# Altium schematic sheet AD.SchDoc
size A2
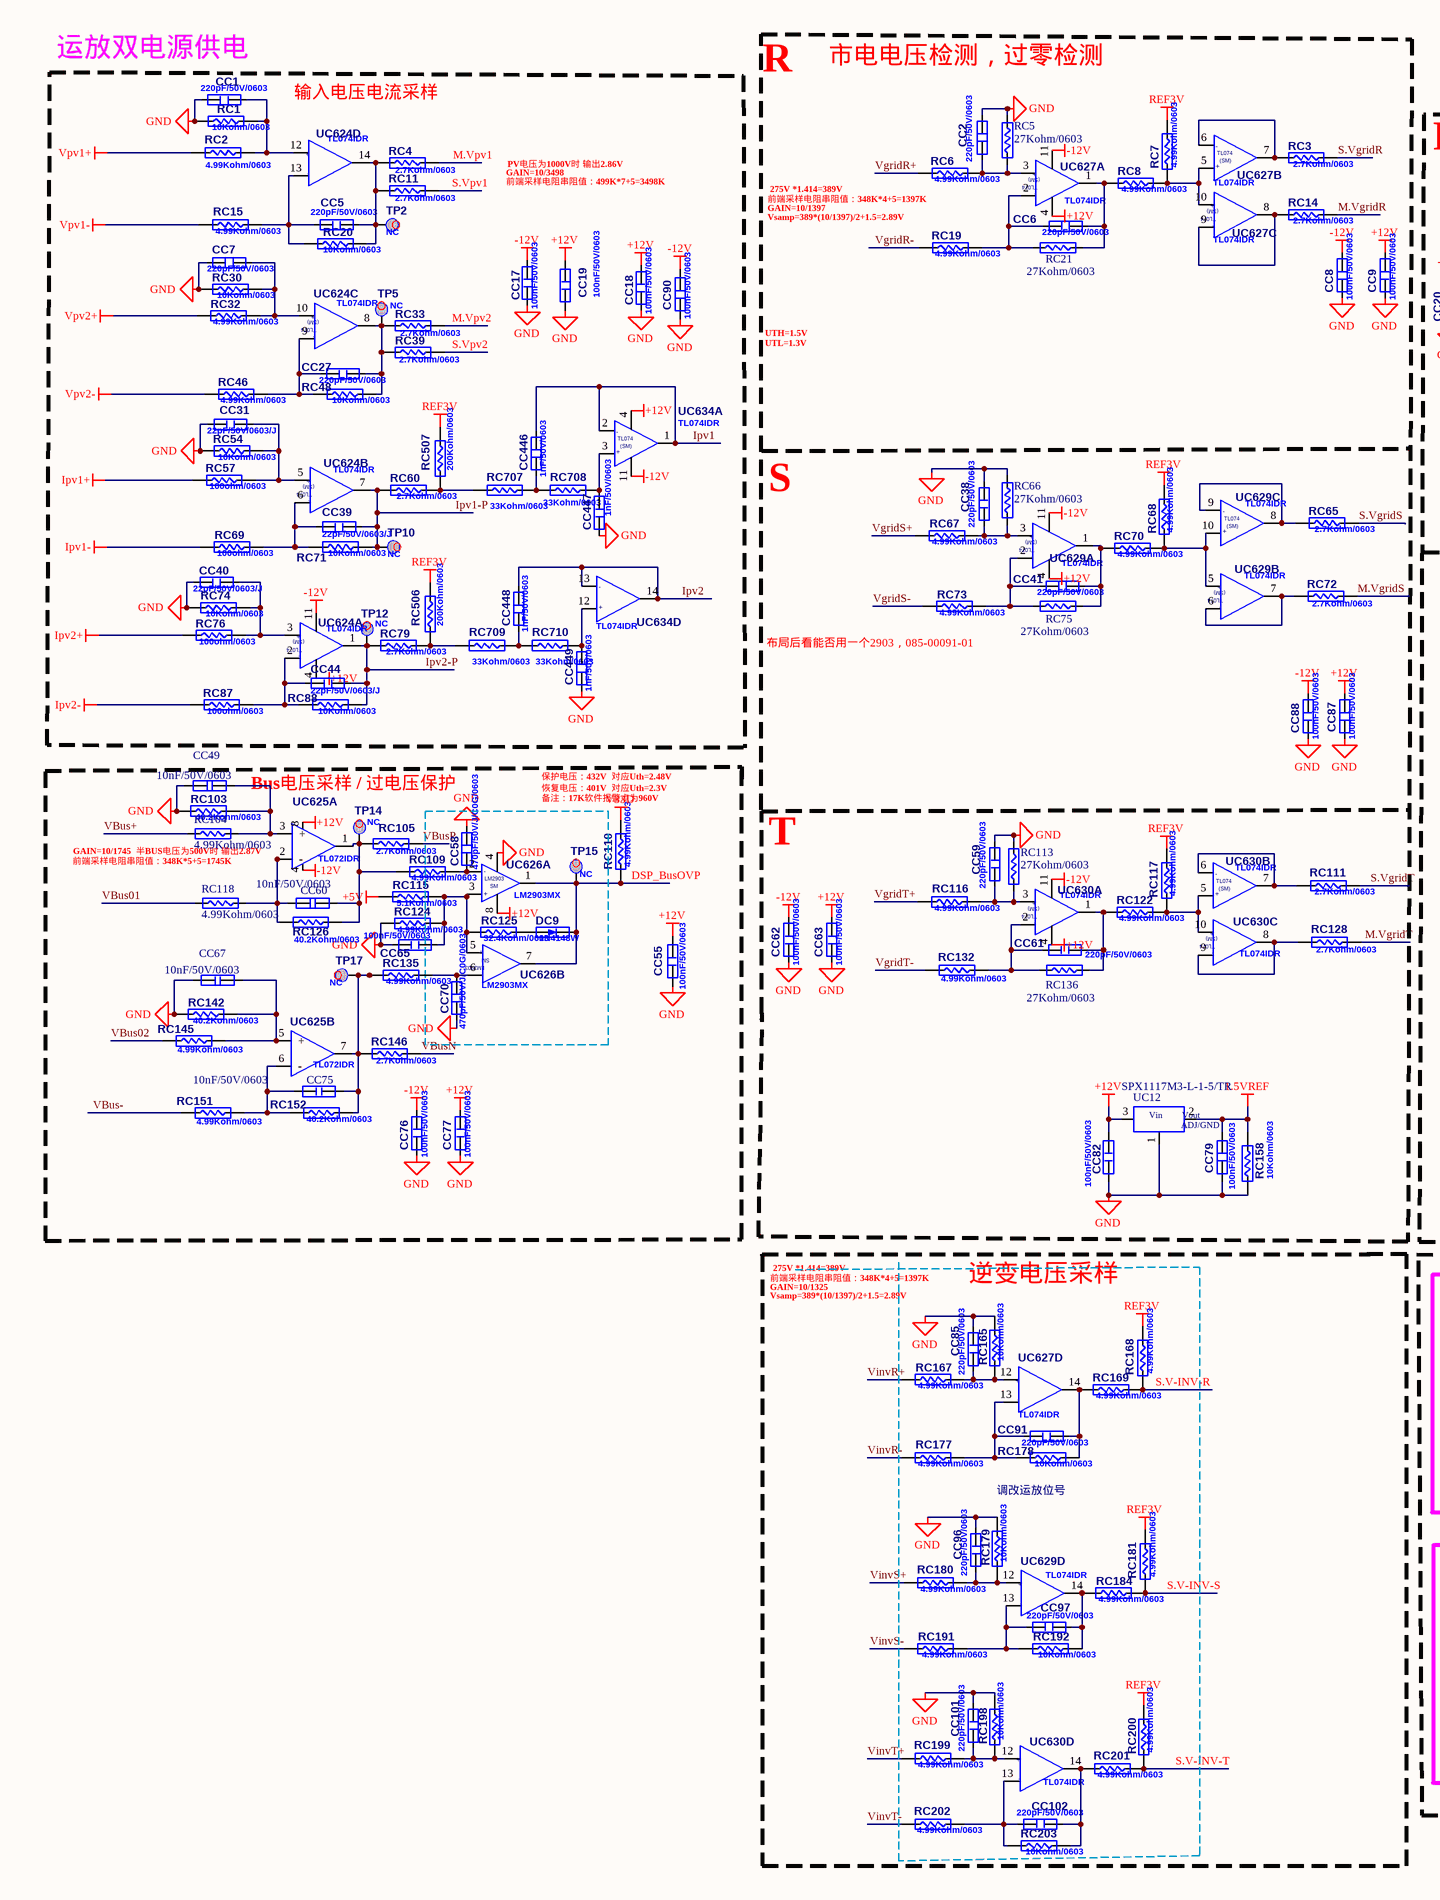
[diagram p0: AD.SchDoc, left]
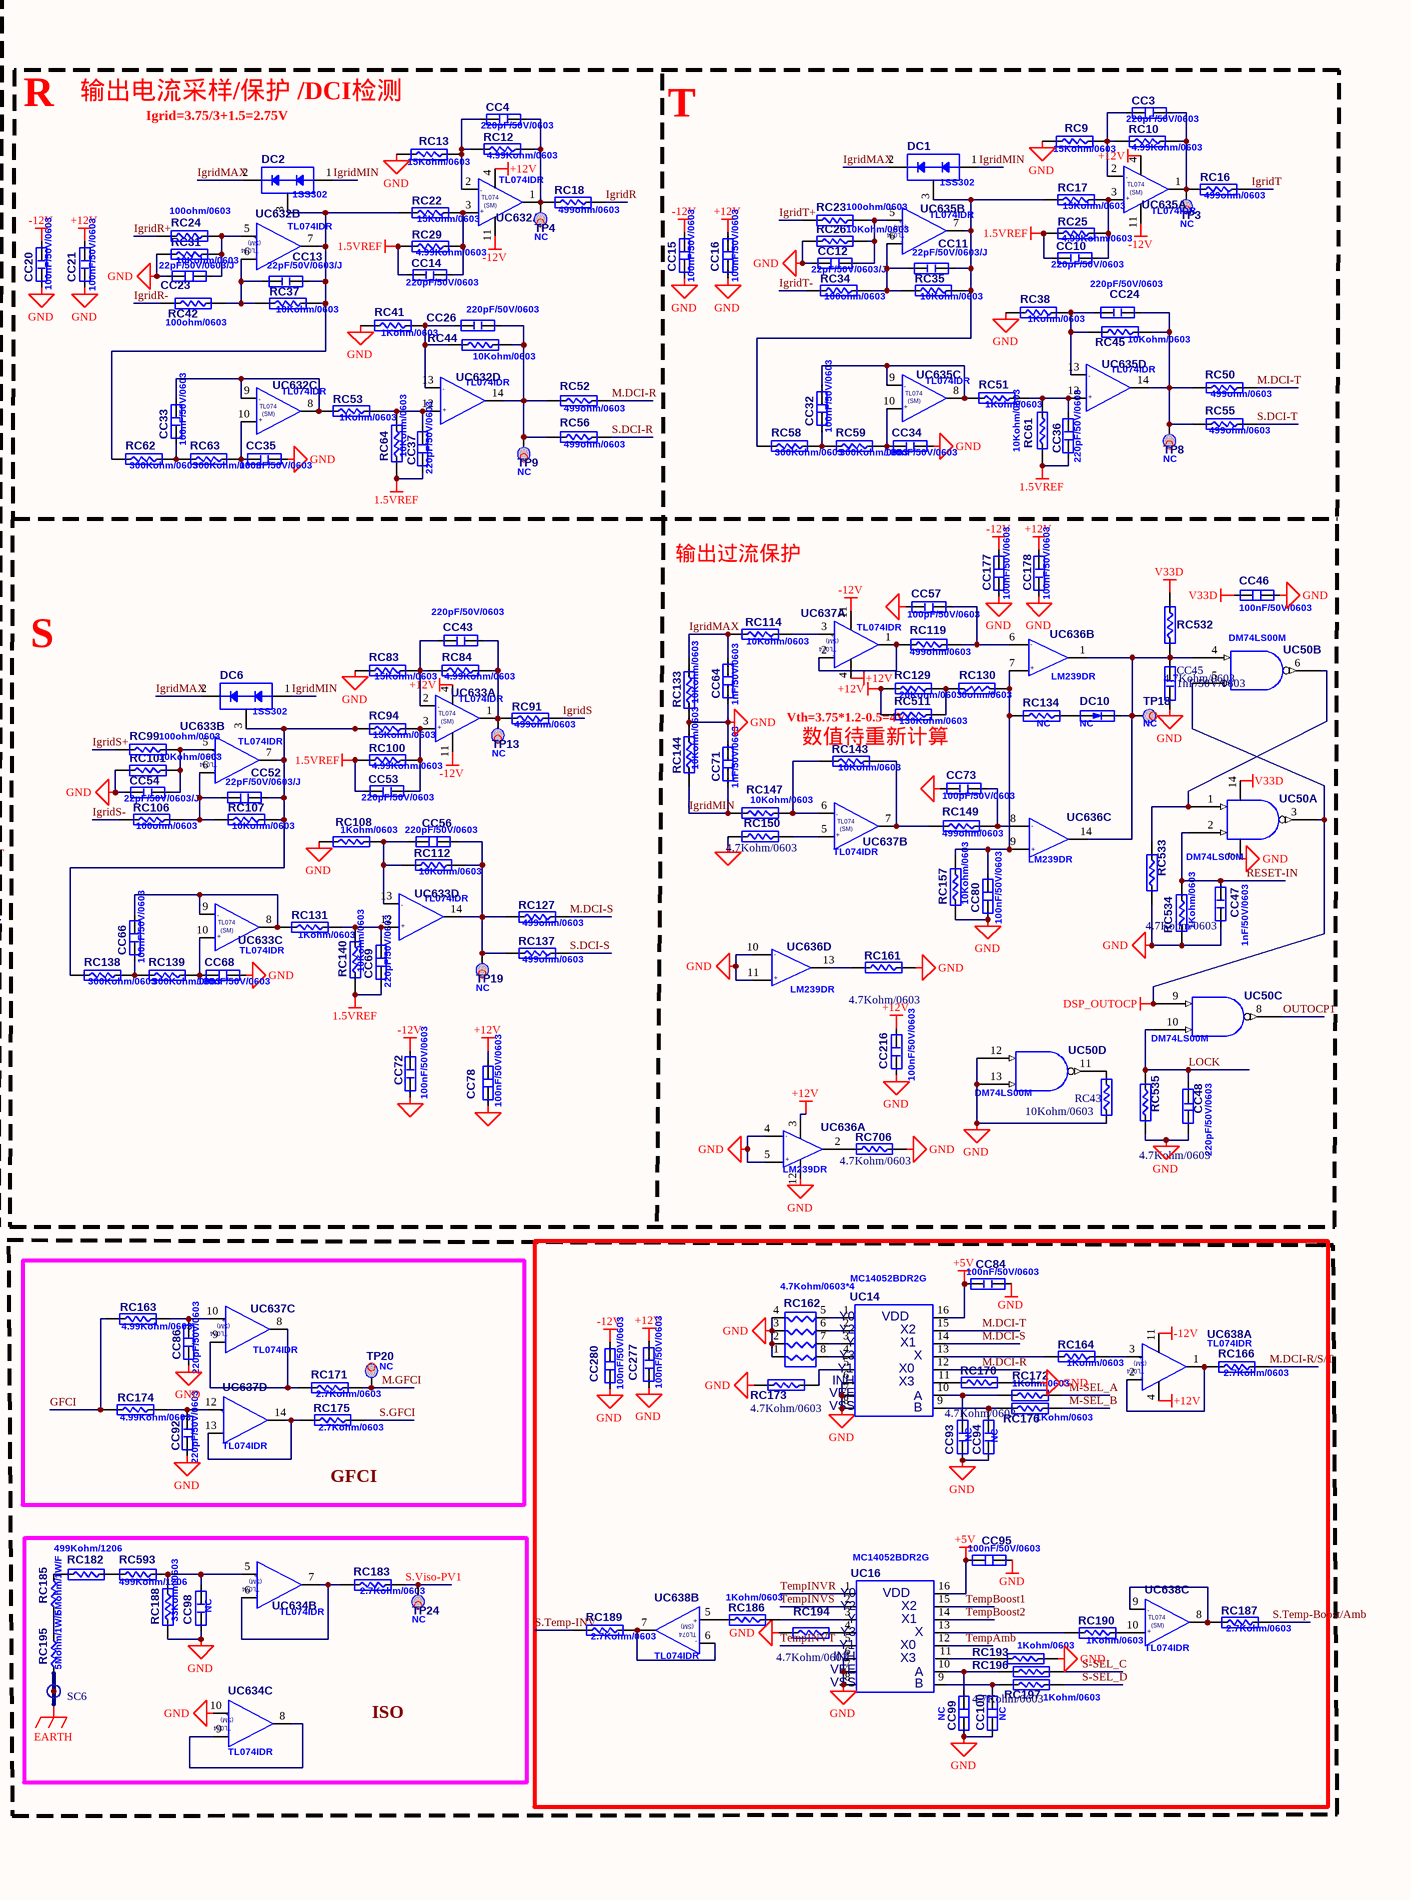
[diagram p1: AD.SchDoc, right]

## Parts
CC1  value 220pF/50V/0603  [CC1608-0603]  (hidden comment: 023-221220-0)
CC2  value 220pF/50V/0603  [CC1608-0603]  (hidden comment: 023-221220-0)
CC3  value 220pF/50V/0603  [CC1608-0603]  (hidden comment: 023-221220-0)
CC4  value 220pF/50V/0603  [CC1608-0603]  (hidden comment: 023-221220-0)
CC5  value 220pF/50V/0603  [CC1608-0603]  (hidden comment: 023-221220-0)
CC6  value 220pF/50V/0603  [CC1608-0603]  (hidden comment: 023-221220-0)
CC7  value 220pF/50V/0603  [CC1608-0603]  (hidden comment: 023-221220-0)
CC8  value 100nF/50V/0603  [CC1608-0603]  (hidden comment: 023-105220-0)
CC9  value 100nF/50V/0603  [CC1608-0603]  (hidden comment: 023-105220-0)
CC10  value 220pF/50V/0603  [CC1608-0603]  (hidden comment: 023-221220-0)
CC11  value 22pF/50V/0603/J  [CC1608-0603]  (hidden comment: 023-220220-0)
CC12  value 22pF/50V/0603/J  [CC1608-0603]  (hidden comment: 023-220220-0)
CC13  value 22pF/50V/0603/J  [CC1608-0603]  (hidden comment: 023-220220-0)
CC14  value 220pF/50V/0603  [CC1608-0603]  (hidden comment: 023-221220-0)
CC15  value 100nF/50V/0603  [CC1608-0603]  (hidden comment: 023-105220-0)
CC16  value 100nF/50V/0603  [CC1608-0603]  (hidden comment: 023-105220-0)
CC17  value 100nF/50V/0603  [CC1608-0603]  (hidden comment: 023-105220-0)
CC18  value 100nF/50V/0603  [CC1608-0603]  (hidden comment: 023-105220-0)
CC19  value 100nF/50V/0603  [CC1608-0603]  (hidden comment: 023-105220-0)
CC20  value 100nF/50V/0603  [CC1608-0603]  (hidden comment: 023-105220-0)
CC21  value 100nF/50V/0603  [CC1608-0603]  (hidden comment: 023-105220-0)
CC23  value 22pF/50V/0603/J  [CC1608-0603]  (hidden comment: 023-220220-0)
CC24  value 220pF/50V/0603  [CC1608-0603]  (hidden comment: 023-221220-0)
CC26  value 220pF/50V/0603  [CC1608-0603]  (hidden comment: 023-221220-0)
CC27  value 220pF/50V/0603  [CC1608-0603]  (hidden comment: 023-221220-0)
CC31  value 22pF/50V/0603/J  [CC1608-0603]  (hidden comment: 023-220220-0)
CC32  value 100nF/50V/0603  [CC1608-0603]  (hidden comment: 023-105220-0)
CC33  value 100nF/50V/0603  [CC1608-0603]  (hidden comment: 023-105220-0)
CC34  value 100nF/50V/0603  [CC1608-0603]  (hidden comment: 023-105220-0)
CC35  value 100nF/50V/0603  [CC1608-0603]  (hidden comment: 023-105220-0)
CC36  value 220pF/50V/0603  [CC1608-0603]  (hidden comment: 023-221220-0)
CC37  value 220pF/50V/0603  [CC1608-0603]  (hidden comment: 023-221220-0)
CC38  value 220pF/50V/0603  [CC1608-0603]  (hidden comment: 023-221220-0)
CC39  value 22pF/50V/0603/J  [CC1608-0603]  (hidden comment: 023-220220-0)
CC40  value 22pF/50V/0603/J  [CC1608-0603]  (hidden comment: 023-220220-0)
CC41  value 220pF/50V/0603  [CC1608-0603]  (hidden comment: 023-221220-0)
CC43  value 220pF/50V/0603  [CC1608-0603]  (hidden comment: 023-221220-0)
CC44  value 22pF/50V/0603/J  [CC1608-0603]  (hidden comment: 023-220220-0)
CC45  value 1nF/50V/0603  [C0603SM]  (hidden comment: 023-102220-0)
CC46  value 100nF/50V/0603  [CC1608-0603]  (hidden comment: 023-105220-0)
CC47  value 1nF/50V/0603  [CC1608-0603]  (hidden comment: 023-102220-0)
CC48  value 220pF/50V/0603  [CC1608-0603]  (hidden comment: 023-221220-0)
CC49  value 10nF/50V/0603  [C0603SM]  (hidden comment: 023-103220-0)
CC52  value 22pF/50V/0603/J  [CC1608-0603]  (hidden comment: 023-220220-0)
CC53  value 220pF/50V/0603  [CC1608-0603]  (hidden comment: 023-221220-0)
CC54  value 22pF/50V/0603/J  [CC1608-0603]  (hidden comment: 023-220220-0)
CC55  value 100nF/50V/0603  [CC1608-0603]  (hidden comment: 023-105220-0)
CC56  value 220pF/50V/0603  [CC1608-0603]  (hidden comment: 023-221220-0)
CC57  value 100pF/50V/0603  [CC1608-0603]  (hidden comment: 023-101220-0)
CC58  value 470pF/50V/J/C0G/0603  [CC1608-0603]  (hidden comment: 023-471220-0)
CC59  value 220pF/50V/0603  [CC1608-0603]  (hidden comment: 023-221220-0)
CC60  value 10nF/50V/0603  [C0603SM]  (hidden comment: 023-103220-0)
CC61  value 220pF/50V/0603  [CC1608-0603]  (hidden comment: 023-221220-0)
CC62  value 100nF/50V/0603  [CC1608-0603]  (hidden comment: 023-105220-0)
CC63  value 100nF/50V/0603  [CC1608-0603]  (hidden comment: 023-105220-0)
CC64  value 1nF/50V/0603  [CC1608-0603]  (hidden comment: 023-102220-0)
CC65  value 100nF/50V/0603  [CC1608-0603]  (hidden comment: 023-105220-0)
CC66  value 100nF/50V/0603  [CC1608-0603]  (hidden comment: 023-105220-0)
CC67  value 10nF/50V/0603  [C0603SM]  (hidden comment: 023-103220-0)
CC68  value 100nF/50V/0603  [CC1608-0603]  (hidden comment: 023-105220-0)
CC69  value 220pF/50V/0603  [CC1608-0603]  (hidden comment: 023-221220-0)
CC70  value 470pF/50V/J/C0G/0603  [CC1608-0603]  (hidden comment: 023-471220-0)
CC71  value 1nF/50V/0603  [CC1608-0603]  (hidden comment: 023-102220-0)
CC72  value 100nF/50V/0603  [CC1608-0603]  (hidden comment: 023-105220-0)
CC73  value 100pF/50V/0603  [CC1608-0603]  (hidden comment: 023-101220-0)
CC75  value 10nF/50V/0603  [C0603SM]  (hidden comment: 023-103220-0)
CC76  value 100nF/50V/0603  [CC1608-0603]  (hidden comment: 023-105220-0)
CC77  value 100nF/50V/0603  [CC1608-0603]  (hidden comment: 023-105220-0)
CC78  value 100nF/50V/0603  [CC1608-0603]  (hidden comment: 023-105220-0)
CC79  value 100nF/50V/0603  [CC1608-0603]  (hidden comment: 023-105220-0)
CC80  value 100nF/50V/0603  [CC1608-0603]  (hidden comment: 023-105220-0)
CC82  value 100nF/50V/0603  [CC1608-0603]  (hidden comment: 023-105220-0)
CC84  value 100nF/50V/0603  [CC1608-0603]  (hidden comment: 023-105220-0)
CC85  value 220pF/50V/0603  [CC1608-0603]  (hidden comment: 023-221220-0)
CC86  value 220pF/50V/0603  [CC1608-0603]  (hidden comment: 023-221220-0)
CC87  value 100nF/50V/0603  [CC1608-0603]  (hidden comment: 023-105220-0)
CC88  value 100nF/50V/0603  [CC1608-0603]  (hidden comment: 023-105220-0)
CC90  value 100nF/50V/0603  [CC1608-0603]  (hidden comment: 023-105220-0)
CC91  value 220pF/50V/0603  [CC1608-0603]  (hidden comment: 023-221220-0)
CC92  value 220pF/50V/0603  [CC1608-0603]  (hidden comment: 023-221220-0)
CC93  NC  [CC1608-0603]
CC94  NC  [CC1608-0603]
CC95  value 100nF/50V/0603  [CC1608-0603]  (hidden comment: 023-105220-0)
CC96  value 220pF/50V/0603  [CC1608-0603]  (hidden comment: 023-221220-0)
CC97  value 220pF/50V/0603  [CC1608-0603]  (hidden comment: 023-221220-0)
CC98  NC  [CC1608-0603]
CC99  NC  [CC1608-0603]
CC100  NC  [CC1608-0603]
CC101  value 220pF/50V/0603  [CC1608-0603]  (hidden comment: 023-221220-0)
CC102  value 220pF/50V/0603  [CC1608-0603]  (hidden comment: 023-221220-0)
CC177  value 100nF/50V/0603  [CC1608-0603]  (hidden comment: 023-105220-0)
CC178  value 100nF/50V/0603  [CC1608-0603]  (hidden comment: 023-105220-0)
CC216  value 100nF/50V/0603  [CC1608-0603]  (hidden comment: 023-105220-0)
CC277  value 100nF/50V/0603  [CC1608-0603]  (hidden comment: 023-105220-0)
CC280  value 100nF/50V/0603  [CC1608-0603]  (hidden comment: 023-105220-0)
CC446  value 1nF/50V/0603  [CC1608-0603]  (hidden comment: 023-102220-0)
CC447  value 1nF/50V/0603  [CC1608-0603]  (hidden comment: 023-102220-0)
CC448  value 1nF/50V/0603  [CC1608-0603]  (hidden comment: 023-102220-0)
CC449  value 1nF/50V/0603  [CC1608-0603]  (hidden comment: 023-102220-0)
DC1  value 1SS302  [SC-70]  (hidden comment: 060-610010-0)
DC2  value 1SS302  [SC-70]  (hidden comment: 060-610010-0)
DC6  value 1SS302  [SC-70]  (hidden comment: 060-610010-0)
DC9  value 1N4148W  [SOD-123]  (hidden comment: 060-500010-0)
DC10  NC  [SOD-123]
RC1  value 10Kohm/0603  [R1608-0603]  (hidden comment: 011-103020-0)
RC2  value 4.99Kohm/0603  [R1608-0603]  (hidden comment: 011-492020-0)
RC3  value 2.7Kohm/0603  [R1608-0603]  (hidden comment: 011-272020-0)
RC4  value 2.7Kohm/0603  [R1608-0603]  (hidden comment: 011-272020-0)
RC5  value 27Kohm/0603  [R0603SM]  (hidden comment: 011-273020-0)
RC6  value 4.99Kohm/0603  [R1608-0603]  (hidden comment: 011-492020-0)
RC7  value 4.99Kohm/0603  [R1608-0603]  (hidden comment: 011-492020-0)
RC8  value 4.99Kohm/0603  [R1608-0603]  (hidden comment: 011-492020-0)
RC9  value 15Kohm/0603  [R1608-0603]  (hidden comment: 011-153020-0)
RC10  value 4.99Kohm/0603  [R1608-0603]  (hidden comment: 011-492020-0)
RC11  value 2.7Kohm/0603  [R1608-0603]  (hidden comment: 011-272020-0)
RC12  value 4.99Kohm/0603  [R1608-0603]  (hidden comment: 011-492020-0)
RC13  value 15Kohm/0603  [R1608-0603]  (hidden comment: 011-153020-0)
RC14  value 2.7Kohm/0603  [R1608-0603]  (hidden comment: 011-272020-0)
RC15  value 4.99Kohm/0603  [R1608-0603]  (hidden comment: 011-492020-0)
RC16  value 499ohm/0603  [R1608-0603]  (hidden comment: 011-491020-0)
RC17  value 15Kohm/0603  [R1608-0603]  (hidden comment: 011-153020-0)
RC18  value 499ohm/0603  [R1608-0603]  (hidden comment: 011-491020-0)
RC19  value 4.99Kohm/0603  [R1608-0603]  (hidden comment: 011-492020-0)
RC20  value 10Kohm/0603  [R1608-0603]  (hidden comment: 011-103020-0)
RC21  value 27Kohm/0603  [R0603SM]  (hidden comment: 011-273020-0)
RC22  value 15Kohm/0603  [R1608-0603]  (hidden comment: 011-153020-0)
RC23  value 100ohm/0603  [R1608-0603]  (hidden comment: 011-101020-0)
RC24  value 100ohm/0603  [R1608-0603]  (hidden comment: 011-101020-0)
RC25  value 4.99Kohm/0603  [R1608-0603]  (hidden comment: 011-492020-0)
RC26  value 10Kohm/0603  [R1608-0603]  (hidden comment: 011-103020-0)
RC29  value 4.99Kohm/0603  [R1608-0603]  (hidden comment: 011-492020-0)
RC30  value 10Kohm/0603  [R1608-0603]  (hidden comment: 011-103020-0)
RC31  value 10Kohm/0603  [R1608-0603]  (hidden comment: 011-103020-0)
RC32  value 4.99Kohm/0603  [R1608-0603]  (hidden comment: 011-492020-0)
RC33  value 2.7Kohm/0603  [R1608-0603]  (hidden comment: 011-272020-0)
RC34  value 100ohm/0603  [R1608-0603]  (hidden comment: 011-101020-0)
RC35  value 10Kohm/0603  [R1608-0603]  (hidden comment: 011-103020-0)
RC37  value 10Kohm/0603  [R1608-0603]  (hidden comment: 011-103020-0)
RC38  value 1Kohm/0603  [R1608-0603]  (hidden comment: 011-102020-0)
RC39  value 2.7Kohm/0603  [R1608-0603]  (hidden comment: 011-272020-0)
RC41  value 1Kohm/0603  [R1608-0603]  (hidden comment: 011-102020-0)
RC42  value 100ohm/0603  [R1608-0603]  (hidden comment: 011-101020-0)
RC43  value 10Kohm/0603  [R0603SM]  (hidden comment: 011-103020-0)
RC44  value 10Kohm/0603  [R1608-0603]  (hidden comment: 011-103020-0)
RC45  value 10Kohm/0603  [R1608-0603]  (hidden comment: 011-103020-0)
RC46  value 4.99Kohm/0603  [R1608-0603]  (hidden comment: 011-492020-0)
RC48  value 10Kohm/0603  [R1608-0603]  (hidden comment: 011-103020-0)
RC50  value 499ohm/0603  [R1608-0603]  (hidden comment: 011-491020-0)
RC51  value 1Kohm/0603  [R1608-0603]  (hidden comment: 011-102020-0)
RC52  value 499ohm/0603  [R1608-0603]  (hidden comment: 011-491020-0)
RC53  value 1Kohm/0603  [R1608-0603]  (hidden comment: 011-102020-0)
RC54  value 10Kohm/0603  [R1608-0603]  (hidden comment: 011-103020-0)
RC55  value 499ohm/0603  [R1608-0603]  (hidden comment: 011-491020-0)
RC56  value 499ohm/0603  [R1608-0603]  (hidden comment: 011-491020-0)
RC57  value 100ohm/0603  [R1608-0603]  (hidden comment: 011-101020-0)
RC58  value 300Kohm/0603  [R1608-0603]  (hidden comment: 011-304021-0)
RC59  value 300Kohm/0603  [R1608-0603]  (hidden comment: 011-304021-0)
RC60  value 2.7Kohm/0603  [R1608-0603]  (hidden comment: 011-272020-0)
RC61  value 10Kohm/0603  [R1608-0603]  (hidden comment: 011-103020-0)
RC62  value 300Kohm/0603  [R1608-0603]  (hidden comment: 011-304021-0)
RC63  value 300Kohm/0603  [R1608-0603]  (hidden comment: 011-304021-0)
RC64  value 10Kohm/0603  [R1608-0603]  (hidden comment: 011-103020-0)
RC65  value 2.7Kohm/0603  [R1608-0603]  (hidden comment: 011-272020-0)
RC66  value 27Kohm/0603  [R0603SM]  (hidden comment: 011-273020-0)
RC67  value 4.99Kohm/0603  [R1608-0603]  (hidden comment: 011-492020-0)
RC68  value 4.99Kohm/0603  [R1608-0603]  (hidden comment: 011-492020-0)
RC69  value 100ohm/0603  [R1608-0603]  (hidden comment: 011-101020-0)
RC70  value 4.99Kohm/0603  [R1608-0603]  (hidden comment: 011-492020-0)
RC71  value 10Kohm/0603  [R1608-0603]  (hidden comment: 011-103020-0)
RC72  value 2.7Kohm/0603  [R1608-0603]  (hidden comment: 011-272020-0)
RC73  value 4.99Kohm/0603  [R1608-0603]  (hidden comment: 011-492020-0)
RC74  value 10Kohm/0603  [R1608-0603]  (hidden comment: 011-103020-0)
RC75  value 27Kohm/0603  [R0603SM]  (hidden comment: 011-273020-0)
RC76  value 100ohm/0603  [R1608-0603]  (hidden comment: 011-101020-0)
RC79  value 2.7Kohm/0603  [R1608-0603]  (hidden comment: 011-272020-0)
RC83  value 15Kohm/0603  [R1608-0603]  (hidden comment: 011-153020-0)
RC84  value 4.99Kohm/0603  [R1608-0603]  (hidden comment: 011-492020-0)
RC87  value 100ohm/0603  [R1608-0603]  (hidden comment: 011-101020-0)
RC88  value 10Kohm/0603  [R1608-0603]  (hidden comment: 011-103020-0)
RC91  value 499ohm/0603  [R1608-0603]  (hidden comment: 011-491020-0)
RC94  value 15Kohm/0603  [R1608-0603]  (hidden comment: 011-153020-0)
RC99  value 100ohm/0603  [R1608-0603]  (hidden comment: 011-101020-0)
RC100  value 4.99Kohm/0603  [R1608-0603]  (hidden comment: 011-492020-0)
RC101  value 10Kohm/0603  [R1608-0603]  (hidden comment: 011-103020-0)
RC103  value 40.2Kohm/0603  [R1608-0603]  (hidden comment: 011-403020-0)
RC104  value 4.99Kohm/0603  [R0603SM]  (hidden comment: 011-492020-0)
RC105  value 2.7Kohm/0603  [R1608-0603]  (hidden comment: 011-272020-0)
RC106  value 100ohm/0603  [R1608-0603]  (hidden comment: 011-101020-0)
RC107  value 10Kohm/0603  [R1608-0603]  (hidden comment: 011-103020-0)
RC108  value 1Kohm/0603  [R1608-0603]  (hidden comment: 011-102020-0)
RC109  value 4.99Kohm/0603  [R1608-0603]  (hidden comment: 011-492020-0)
RC110  value 4.99Kohm/0603  [R1608-0603]  (hidden comment: 011-492020-0)
RC111  value 2.7Kohm/0603  [R1608-0603]  (hidden comment: 011-272020-0)
RC112  value 10Kohm/0603  [R1608-0603]  (hidden comment: 011-103020-0)
RC113  value 27Kohm/0603  [R0603SM]  (hidden comment: 011-273020-0)
RC114  value 10Kohm/0603  [R1608-0603]  (hidden comment: 011-103020-0)
RC115  value 5.1Kohm/0603  [R1608-0603]  (hidden comment: 011-512020-0)
RC116  value 4.99Kohm/0603  [R1608-0603]  (hidden comment: 011-492020-0)
RC117  value 4.99Kohm/0603  [R1608-0603]  (hidden comment: 011-492020-0)
RC118  value 4.99Kohm/0603  [R0603SM]  (hidden comment: 011-492020-0)
RC119  value 499ohm/0603  [R1608-0603]  (hidden comment: 011-491020-0)
RC122  value 4.99Kohm/0603  [R1608-0603]  (hidden comment: 011-492020-0)
RC124  value 4.99Kohm/0603  [R1608-0603]  (hidden comment: 011-492020-0)
RC125  value 32.4Kohm/0603  [R1608-0603]  (hidden comment: 011-323020-0)
RC126  value 40.2Kohm/0603  [R1608-0603]  (hidden comment: 011-403020-0)
RC127  value 499ohm/0603  [R1608-0603]  (hidden comment: 011-491020-0)
RC128  value 2.7Kohm/0603  [R1608-0603]  (hidden comment: 011-272020-0)
RC129  value 20Kohm/0603  [R1608-0603]  (hidden comment: 011-203020-0)
RC130  value 0ohm/0603  [R1608-0603]  (hidden comment: 011-000020-0)
RC131  value 1Kohm/0603  [R1608-0603]  (hidden comment: 011-102020-0)
RC132  value 4.99Kohm/0603  [R1608-0603]  (hidden comment: 011-492020-0)
RC133  value 10Kohm/0603  [R1608-0603]  (hidden comment: 011-103020-0)
RC134  NC  [R1608-0603]
RC135  value 4.99Kohm/0603  [R1608-0603]  (hidden comment: 011-492020-0)
RC136  value 27Kohm/0603  [R0603SM]  (hidden comment: 011-273020-0)
RC137  value 499ohm/0603  [R1608-0603]  (hidden comment: 011-491020-0)
RC138  value 300Kohm/0603  [R1608-0603]  (hidden comment: 011-304021-0)
RC139  value 300Kohm/0603  [R1608-0603]  (hidden comment: 011-304021-0)
RC140  value 10Kohm/0603  [R1608-0603]  (hidden comment: 011-103020-0)
RC142  value 40.2Kohm/0603  [R1608-0603]  (hidden comment: 011-403020-0)
RC143  value 10Kohm/0603  [R1608-0603]  (hidden comment: 011-103020-0)
RC144  value 10Kohm/0603  [R1608-0603]  (hidden comment: 011-103020-0)
RC145  value 4.99Kohm/0603  [R1608-0603]  (hidden comment: 011-492020-0)
RC146  value 2.7Kohm/0603  [R1608-0603]  (hidden comment: 011-272020-0)
RC147  value 10Kohm/0603  [R1608-0603]  (hidden comment: 011-103020-0)
RC149  value 499ohm/0603  [R1608-0603]  (hidden comment: 011-491020-0)
RC150  value 4.7Kohm/0603  [R1608-0603]  (hidden comment: 011-472020-0)
RC151  value 4.99Kohm/0603  [R1608-0603]  (hidden comment: 011-492020-0)
RC152  value 40.2Kohm/0603  [R1608-0603]  (hidden comment: 011-403020-0)
RC157  value 10Kohm/0603  [R1608-0603]  (hidden comment: 011-103020-0)
RC158  value 10Kohm/0603  [R1608-0603]  (hidden comment: 011-103020-0)
RC161  value 4.7Kohm/0603  [R1608-0603]  (hidden comment: 011-472020-0)
RC162  value 4.7Kohm/0603*4  [RN0603*4]  (hidden comment: 019-472000-0)
RC163  value 4.99Kohm/0603  [R1608-0603]  (hidden comment: 011-492020-0)
RC164  value 1Kohm/0603  [R1608-0603]  (hidden comment: 011-102020-0)
RC165  value 10Kohm/0603  [R1608-0603]  (hidden comment: 011-103020-0)
RC166  value 2.7Kohm/0603  [R1608-0603]  (hidden comment: 011-272020-0)
RC167  value 4.99Kohm/0603  [R1608-0603]  (hidden comment: 011-492020-0)
RC168  value 4.99Kohm/0603  [R1608-0603]  (hidden comment: 011-492020-0)
RC169  value 4.99Kohm/0603  [R1608-0603]  (hidden comment: 011-492020-0)
RC170  value 4.7Kohm/0603  [R1608-0603]  (hidden comment: 011-472020-0)
RC171  value 2.7Kohm/0603  [R1608-0603]  (hidden comment: 011-272020-0)
RC172  value 1Kohm/0603  [R1608-0603]  (hidden comment: 011-102020-0)
RC173  value 4.7Kohm/0603  [R1608-0603]  (hidden comment: 011-472020-0)
RC174  value 4.99Kohm/0603  [R1608-0603]  (hidden comment: 011-492020-0)
RC175  value 2.7Kohm/0603  [R1608-0603]  (hidden comment: 011-272020-0)
RC176  value 1Kohm/0603  [R1608-0603]  (hidden comment: 011-102020-0)
RC177  value 4.99Kohm/0603  [R1608-0603]  (hidden comment: 011-492020-0)
RC178  value 10Kohm/0603  [R1608-0603]  (hidden comment: 011-103020-0)
RC179  value 10Kohm/0603  [R1608-0603]  (hidden comment: 011-103020-0)
RC180  value 4.99Kohm/0603  [R1608-0603]  (hidden comment: 011-492020-0)
RC181  value 4.99Kohm/0603  [R1608-0603]  (hidden comment: 011-492020-0)
RC182  value 499Kohm/1206  [R3216-1206]  (hidden comment: 011-494050-0)
RC183  value 2.7Kohm/0603  [R1608-0603]  (hidden comment: 011-272020-0)
RC184  value 4.99Kohm/0603  [R1608-0603]  (hidden comment: 011-492020-0)
RC185  value 5Mohm/1W/F  [R3W-S]  (hidden comment: 013-515220-1)
RC186  value 1Kohm/0603  [R1608-0603]  (hidden comment: 011-102020-0)
RC187  value 2.7Kohm/0603  [R1608-0603]  (hidden comment: 011-272020-0)
RC188  value 33Kohm/0603  [R1608-0603]  (hidden comment: 011-333020-0)
RC189  value 2.7Kohm/0603  [R1608-0603]  (hidden comment: 011-272020-0)
RC190  value 1Kohm/0603  [R1608-0603]  (hidden comment: 011-102020-0)
RC191  value 4.99Kohm/0603  [R1608-0603]  (hidden comment: 011-492020-0)
RC192  value 10Kohm/0603  [R1608-0603]  (hidden comment: 011-103020-0)
RC193  value 4.7Kohm/0603  [R1608-0603]  (hidden comment: 011-472020-0)
RC194  value 4.7Kohm/0603  [R1608-0603]  (hidden comment: 011-472020-0)
RC195  value 5Mohm/1W/F  [R3W-S]  (hidden comment: 013-515220-1)
RC196  value 1Kohm/0603  [R1608-0603]  (hidden comment: 011-102020-0)
RC197  value 1Kohm/0603  [R1608-0603]  (hidden comment: 011-102020-0)
RC198  value 10Kohm/0603  [R1608-0603]  (hidden comment: 011-103020-0)
RC199  value 4.99Kohm/0603  [R1608-0603]  (hidden comment: 011-492020-0)
RC200  value 4.99Kohm/0603  [R1608-0603]  (hidden comment: 011-492020-0)
RC201  value 4.99Kohm/0603  [R1608-0603]  (hidden comment: 011-492020-0)
RC202  value 4.99Kohm/0603  [R1608-0603]  (hidden comment: 011-492020-0)
RC203  value 10Kohm/0603  [R1608-0603]  (hidden comment: 011-103020-0)
RC506  value 200Kohm/0603  [R1608-0603]  (hidden comment: 011-204020-0)
RC507  value 200Kohm/0603  [R1608-0603]  (hidden comment: 011-204020-0)
RC511  value 130Kohm/0603  [R1608-0603]  (hidden comment: 011-131020-0)
RC532  value 4.7Kohm/0603  [R1608-0603]  (hidden comment: 011-472020-0)
RC533  value 4.7Kohm/0603  [R1608-0603]  (hidden comment: 011-472020-0)
RC534  value 1Kohm/0603  [R1608-0603]  (hidden comment: 011-102020-0)
RC535  value 4.7Kohm/0603  [R1608-0603]  (hidden comment: 011-472020-0)
RC593  value 499Kohm/1206  [R3216-1206]  (hidden comment: 011-494050-0)
RC706  value 4.7Kohm/0603  [R1608-0603]  (hidden comment: 011-472020-0)
RC707  value 33Kohm/0603  [R1608-0603]  (hidden comment: 011-333020-0)
RC708  value 33Kohm/0603  [R1608-0603]  (hidden comment: 011-333020-0)
RC709  value 33Kohm/0603  [R1608-0603]  (hidden comment: 011-333020-0)
RC710  value 33Kohm/0603  [R1608-0603]  (hidden comment: 011-333020-0)
SC6  SC40(M4)  [SC50_M4-GND]  (value not drawn)
TP2  NC  [TEST-12]
TP3  NC  [TEST-12]
TP4  NC  [TEST-12]
TP5  NC  [TEST-12]
TP8  NC  [TEST-12]
TP9  NC  [TEST-12]
TP10  NC  [TEST-12]
TP12  NC  [TEST-12]
TP13  NC  [TEST-12]
TP14  NC  [TEST-12]
TP15  NC  [TEST-12]
TP17  NC  [TEST-12]
TP18  NC  [TEST-12]
TP19  NC  [TEST-12]
TP20  NC  [TEST-12]
TP24  NC  [TEST-12]
UC12  value SPX1117M3-L-1-5/TR  [SOT223]  (hidden comment: 050-210000-0)
UC14  value MC14052BDR2G  [SO16]  (hidden comment: 050-610312-0)
UC16  value MC14052BDR2G  [SO16]  (hidden comment: 050-610312-0)
UC50  050-510021-0  [SO14]  (value not drawn)  (parts A,B,C,D of 4)
UC624  value TL074IDR  [SO14]  (hidden comment: 050-612020-0)  (parts A,B,C,D of 4)
UC625  value TL072IDR  [SO8]  (hidden comment: 050-610000-0)  (parts A,B of 2)
UC626  value LM2903MX  [SO8]  (hidden comment: 050-610040-0)  (parts A,B of 2)
UC627  value TL074IDR  [SO14]  (hidden comment: 050-612020-0)  (parts A,B,C,D of 4)
UC629  value TL074IDR  [SO14]  (hidden comment: 050-612020-0)  (parts A,B,C,D of 4)
UC630  value TL074IDR  [SO14]  (hidden comment: 050-612020-0)  (parts A,B,C,D of 4)
UC632  value TL074IDR  [SO14]  (hidden comment: 050-612020-0)  (parts A,B,C,D of 4)
UC633  value TL074IDR  [SO14]  (hidden comment: 050-612020-0)  (parts A,B,C,D of 4)
UC634  value TL074IDR  [SO14]  (hidden comment: 050-612020-0)  (parts A,B,C,D of 4)
UC635  value TL074IDR  [SO14]  (hidden comment: 050-612020-0)  (parts A,B,C,D of 4)
UC636  value LM239DR  [SO14]  (hidden comment: 050-610030-0)  (parts A,B,C,D of 4)
UC637  value TL074IDR  [SO14]  (hidden comment: 050-612020-0)  (parts A,B,C,D of 4)
UC638  value TL074IDR  [SO14]  (hidden comment: 050-612020-0)  (parts A,B,C of 4)

## Blocks framed on the sheet
运放双电源供电: CC1 CC5 CC7 CC17-CC19 CC27 CC31 CC39 CC40 CC44 CC90 CC446-CC449 RC1 RC2 RC4 RC11 RC15 RC20 RC30 RC32 RC33 RC39 RC46 RC48 RC54 RC57 RC60 RC69 RC71 RC74 RC76 RC79 RC87 RC88 RC506 RC507 RC707-RC710 TP2 TP5 TP10 TP12 UC624 UC634
GFCI: CC86 CC92 RC163 RC171 RC174 RC175 TP20 UC637
ISO: CC98 RC182 RC183 RC185 RC188 RC195 RC593 SC6 TP24 UC634

## Nets
1.5VREF: CC10.2 CC14.2 CC36.2 CC37.2 CC53.2 CC69.2 CC79.1 RC25.2 RC29.2 RC61.1 RC64.1 RC100.2 RC140.1 RC158.2 UC12.2(Vout)
+5V: CC84.2 CC95.2 RC115.2 UC14.16 UC16.16
+12V: CC9.1 CC16.1 CC18.1 CC19.2 CC21.1 CC55.2 CC63.1 CC77.1 CC78.2 CC82.1 CC87.1 CC178.1 CC216.2 CC277.1 RC129.2 RC511.2 UC12.3(Vin) UC624.4 UC625.8(+15V) UC626.8 UC627.4 UC629.4 UC630.4 UC632.4 UC633.4 UC634.4 UC635.4 UC636.3 UC637.4 UC638.4
-12V: CC8.1 CC15.1 CC17.1 CC20.1 CC62.1 CC72.2 CC76.1 CC88.1 CC90.2 CC177.1 CC280.1 UC624.11 UC625.4(-15V) UC627.11 UC629.11 UC630.11 UC632.11 UC633.11 UC634.11 UC635.11 UC637.11 UC638.11
DSP_OUTOCP: UC50.3 UC50.5 UC50.9
EARTH: RC195.2 SC6.1
GND: CC1.1 CC2.1 CC7.1 CC8.2 CC9.2 CC12.2 CC15.2 CC16.2 CC17.2 CC18.2 CC19.1 CC20.2 CC21.2 CC23.2 CC31.2 CC34.2 CC35.2 CC38.1 CC40.2 CC45.1 CC46.2 CC47.1 CC48.2 CC49.1 CC54.2 CC55.1 CC57.1 CC58.1 CC59.1 CC62.2 CC63.2 CC64.1 CC65.1 CC67.1 CC68.2 CC70.2 CC71.2 CC72.1 CC73.1 CC76.2 CC77.2 CC78.1 CC79.2 CC80.2 CC82.2 CC84.1 CC85.1 CC86.1 CC87.2 CC88.2 CC90.1 CC92.1 CC93.1 CC94.1 CC95.1 CC96.1 CC98.1 CC99.1 CC100.1 CC101.1 CC177.2 CC178.2 CC216.1 CC277.2 CC280.2 CC447.2 CC449.2 RC1.1 RC5.2 RC9.1 RC13.1 RC26.2 RC30.2 RC31.2 RC38.1 RC41.1 RC43.1 RC54.2 RC66.2 RC74.2 RC83.1 RC101.2 RC103.2 RC108.1 RC113.2 RC124.2 RC133.1 RC142.2 RC144.2 RC150.1 RC157.2 RC158.1 RC161.2 RC162.1 RC162.2 RC162.3 RC162.4 RC165.1 RC170.1 RC173.2 RC179.1 RC188.1 RC193.2 RC194.2 RC198.1 RC533.1 RC534.1 RC535.1 RC706.2 UC12.1(ADJ) UC14.6 UC14.7 UC14.8 UC16.6 UC16.7 UC16.8 UC50.7(GND) UC50.12 UC50.13 UC626.4 UC634.10 UC636.4 UC636.5 UC636.10 UC636.11 UC636.12
Ipv1+: RC57.2
Ipv1-: RC69.2
Ipv2+: RC76.2
Ipv2-: RC87.2
REF3V: RC7.1 RC68.1 RC117.1 RC168.1 RC181.1 RC200.1 RC506.1 RC507.1
V33D: CC46.1 RC110.1 RC532.1 UC50.14(VCC)
Vpv1+: RC2.2
Vpv1-: RC15.2
Vpv2+: RC32.2
Vpv2-: RC46.2
DSP_BusOVP: DC9.2 RC110.2 TP15.1 UC626.1 UC626.7
GFCI: RC163.1 RC174.1
IgridMAX: CC64.2 DC1.2 DC2.2 DC6.2 RC114.2 RC133.2
IgridMIN: CC71.1 DC1.1 DC2.1 DC6.1 RC144.1 RC147.2
IgridR: RC18.1
IgridR+: RC24.2
IgridR-: RC42.2
IgridS: RC91.1
IgridS+: RC99.2
IgridS-: RC106.2
IgridT: RC16.1
IgridT+: RC23.2
IgridT-: RC34.2
Ipv1: CC446.1 UC634.1 UC634.2
Ipv1-P: CC39.1 RC60.2 RC71.1 TP10.1 UC624.7
Ipv2: CC448.1 UC634.13 UC634.14
Ipv2-P: CC44.2 RC79.2 RC88.1 TP12.1 UC624.1
LOCK: CC48.1 RC535.2 UC50.10
M-SEL_A: RC172.2
M-SEL_B: RC176.2
M.DCI-R: RC52.1 UC14.12
M.DCI-R/S/T: RC166.2
M.DCI-S: RC127.1 UC14.14
M.DCI-T: RC50.1 UC14.15
M.GFCI: RC171.2 TP20.1
M.VgridR: RC14.2
M.VgridS: RC72.2
M.VgridT: RC128.2
M.Vpv1: RC4.2
M.Vpv2: RC33.2
OUTOCP1: UC50.8
RESET-IN: CC47.2 RC534.2 UC50.2
S-SEL_C: RC196.2
S-SEL_D: RC197.2
S.DCI-R: RC56.1
S.DCI-S: RC137.1
S.DCI-T: RC55.1
S.GFCI: RC175.2
S.Temp-Boost/Amb: RC187.1
S.Temp-INV: RC189.2
S.V-INV-R: RC168.2 RC169.1
S.V-INV-S: RC181.2 RC184.1
S.V-INV-T: RC200.2 RC201.1
S.VgridR: RC3.2
S.VgridS: RC65.2
S.VgridT: RC111.2
S.Viso-PV1: RC183.2 TP24.1
S.Vpv1: RC11.2
S.Vpv2: RC39.2
TempAmb: UC16.12
TempBoost1: UC16.15
TempBoost2: UC16.14
TempINVR: UC16.1
TempINVS: UC16.2
TempINVT: UC16.5
VBus01: RC118.1
VBus02: RC145.1
VBus+: RC104.1
VBus-: RC151.1
VBusN: RC146.1
VBusP: RC105.1
VgridR+: RC6.2
VgridR-: RC19.1
VgridS+: RC67.2
VgridS-: RC73.1
VgridT+: RC116.2
VgridT-: RC132.1
VinvR+: RC167.1
VinvR-: RC177.1
VinvS+: RC180.1
VinvS-: RC191.1
VinvT+: RC199.1
VinvT-: RC202.1
NetCC1_2: CC1.2 RC1.2 RC2.1 UC624.12
NetCC2_2: CC2.2 RC5.1 RC6.1 UC627.3
NetCC3_1: CC3.1 RC10.1 RC16.2 TP3.1 UC635.1
NetCC3_2: CC3.2 RC9.2 RC10.2 UC635.2
NetCC4_1: CC4.1 RC12.1 RC18.2 TP4.1 UC632.1
NetCC4_2: CC4.2 RC12.2 RC13.2 UC632.2
NetCC5_1: CC5.1 RC4.1 RC11.1 RC20.1 TP2.1 UC624.14
NetCC5_2: CC5.2 RC15.1 RC20.2 UC624.13
NetCC6_1: CC6.1 RC8.2 RC21.2 UC627.1
NetCC6_2: CC6.2 RC19.2 RC21.1 UC627.2
NetCC7_2: CC7.2 RC30.1 RC32.1 UC624.10
NetCC10_1: CC10.1 RC17.2 RC25.1 UC635.3
NetCC11_1: CC11.1 DC1.3 RC17.1 RC35.1 RC58.2 UC635.7
NetCC11_2: CC11.2 RC34.1 RC35.2 UC635.6
NetCC12_1: CC12.1 RC23.1 RC26.1 UC635.5
NetCC13_1: CC13.1 DC2.3 RC22.1 RC37.1 RC62.2 UC632.7
NetCC13_2: CC13.2 RC37.2 RC42.1 UC632.6
NetCC14_1: CC14.1 RC22.2 RC29.1 UC632.3
NetCC23_1: CC23.1 RC24.1 RC31.1 UC632.5
NetCC24_1: CC24.1 RC45.2 RC50.2 RC55.2 TP8.1 UC635.14
NetCC24_2: CC24.2 RC38.2 RC45.1 UC635.13
NetCC26_1: CC26.1 RC41.2 RC44.1 UC632.13
NetCC26_2: CC26.2 RC44.2 RC52.2 RC56.2 TP9.1 UC632.14
NetCC27_1: CC27.1 RC33.1 RC39.1 RC48.1 TP5.1 UC624.8
NetCC27_2: CC27.2 RC46.1 RC48.2 UC624.9
NetCC31_1: CC31.1 RC54.1 RC57.1 UC624.5
NetCC32_1: CC32.1 RC51.1 UC635.8 UC635.9
NetCC32_2: CC32.2 RC58.1 RC59.2
NetCC33_1: CC33.1 RC53.1 UC632.8 UC632.9
NetCC33_2: CC33.2 RC62.1 RC63.2
NetCC34_1: CC34.1 RC59.1 UC635.10
NetCC35_1: CC35.1 RC63.1 UC632.10
NetCC36_1: CC36.1 RC51.2 RC61.2 UC635.12
NetCC37_1: CC37.1 RC53.2 RC64.2 UC632.12
NetCC38_2: CC38.2 RC66.1 RC67.1 UC629.3
NetCC39_2: CC39.2 RC69.1 RC71.2 UC624.6
NetCC40_1: CC40.1 RC74.1 RC76.1 UC624.3
NetCC41_1: CC41.1 RC70.2 RC75.2 UC629.1
NetCC41_2: CC41.2 RC73.2 RC75.1 UC629.2
NetCC43_1: CC43.1 RC84.1 RC91.2 TP13.1 UC633.1
NetCC43_2: CC43.2 RC83.2 RC84.2 UC633.2
NetCC44_1: CC44.1 RC87.1 RC88.2 UC624.2
NetCC45_2: CC45.2 DC10.2 RC532.2 TP18.1 UC50.4 UC636.1 UC636.14
NetCC49_2: CC49.2 RC103.1 RC104.2 UC625.3(+)
NetCC52_1: CC52.1 DC6.3 RC94.1 RC107.1 RC138.2 UC633.7
NetCC52_2: CC52.2 RC106.1 RC107.2 UC633.6
NetCC53_1: CC53.1 RC94.2 RC100.1 UC633.3
NetCC54_1: CC54.1 RC99.1 RC101.1 UC633.5
NetCC56_1: CC56.1 RC112.2 RC127.2 RC137.2 TP19.1 UC633.14
NetCC56_2: CC56.2 RC108.2 RC112.1 UC633.13
NetCC57_2: CC57.2 RC119.2 UC636.6
NetCC58_2: CC58.2 RC109.1 UC626.2
NetCC59_2: CC59.2 RC113.1 RC116.1 UC630.3
NetCC60_1: CC60.1 RC118.2 RC126.2 UC625.2(-)
NetCC60_2: CC60.2 RC105.2 RC109.2 RC126.1 TP14.1 UC625.1
NetCC61_1: CC61.1 RC122.2 RC136.2 UC630.1
NetCC61_2: CC61.2 RC132.2 RC136.1 UC630.2
NetCC65_2: CC65.2 RC115.1 RC124.1 RC125.2 UC626.3 UC626.5
NetCC66_1: CC66.1 RC131.1 UC633.8 UC633.9
NetCC66_2: CC66.2 RC138.1 RC139.2
NetCC67_2: CC67.2 RC142.1 RC145.2 UC625.5(+)
NetCC68_1: CC68.1 RC139.1 UC633.10
NetCC69_1: CC69.1 RC131.2 RC140.2 UC633.12
NetCC70_1: CC70.1 RC135.1 UC626.6
NetCC73_2: CC73.2 RC149.2 UC636.8
NetCC75_1: CC75.1 RC151.2 RC152.2 UC625.6(-)
NetCC75_2: CC75.2 RC135.2 RC146.2 RC152.1 TP17.1 UC625.7
NetCC80_1: CC80.1 RC130.1 RC134.1 RC157.1 UC636.7 UC636.9
NetCC85_2: CC85.2 RC165.2 RC167.2 UC627.12
NetCC86_2: CC86.2 RC163.2 UC637.10
NetCC91_1: CC91.1 RC177.2 RC178.2 UC627.13
NetCC91_2: CC91.2 RC169.2 RC178.1 UC627.14
NetCC92_2: CC92.2 RC174.2 UC637.12
NetCC93_2: CC93.2 RC172.1 UC14.10
NetCC94_2: CC94.2 RC176.1 UC14.9
NetCC96_2: CC96.2 RC179.2 RC180.2 UC629.12
NetCC97_1: CC97.1 RC191.2 RC192.2 UC629.13
NetCC97_2: CC97.2 RC184.2 RC192.1 UC629.14
NetCC98_2: CC98.2 RC188.2 RC593.2 UC634.5
NetCC99_2: CC99.2 RC196.1 UC16.10
NetCC100_2: CC100.2 RC197.1 UC16.9
NetCC101_2: CC101.2 RC198.2 RC199.2 UC630.12
NetCC102_1: CC102.1 RC202.2 RC203.2 UC630.13
NetCC102_2: CC102.2 RC201.2 RC203.1 UC630.14
NetCC446_2: CC446.2 RC707.1 RC708.2
NetCC447_1: CC447.1 RC708.1 UC634.3
NetCC448_2: CC448.2 RC709.1 RC710.2
NetCC449_1: CC449.1 RC710.1 UC634.12
NetDC9_1: DC9.1 RC125.1
NetDC10_1: DC10.1 RC134.2
NetRC3_1: RC3.1 UC627.6 UC627.7
NetRC7_2: RC7.2 RC8.1 UC627.5 UC627.10
NetRC14_1: RC14.1 UC627.8 UC627.9
NetRC43_2: RC43.2 UC50.11
NetRC60_1: RC60.1 RC507.2 RC707.2
NetRC65_1: RC65.1 UC629.8 UC629.9
NetRC68_2: RC68.2 RC70.1 UC629.5 UC629.10
NetRC72_1: RC72.1 UC629.6 UC629.7
NetRC79_1: RC79.1 RC506.2 RC709.2
NetRC111_1: RC111.1 UC630.6 UC630.7
NetRC114_1: RC114.1 UC637.3
NetRC117_2: RC117.2 RC122.1 UC630.5 UC630.10
NetRC119_1: RC119.1 UC637.1 UC637.2
NetRC128_1: RC128.1 UC630.8 UC630.9
NetRC129_1: RC129.1 RC130.2 RC511.1
NetRC143_1: RC143.1 RC149.1 UC637.7
NetRC143_2: RC143.2 RC147.1 UC637.6
NetRC150_2: RC150.2 UC637.5
NetRC161_1: RC161.1 UC636.13
NetRC162_5: RC162.5 UC14.1
NetRC162_6: RC162.6 UC14.2
NetRC162_7: RC162.7 UC14.3
NetRC162_8: RC162.8 UC14.4
NetRC164_1: RC164.1 UC638.3
NetRC164_2: RC164.2 UC14.13
NetRC166_1: RC166.1 UC638.1 UC638.2
NetRC170_2: RC170.2 UC14.11
NetRC171_1: RC171.1 UC637.8 UC637.9
NetRC173_1: RC173.1 UC14.5
NetRC175_1: RC175.1 UC637.13 UC637.14
NetRC182_1: RC182.1 RC185.1
NetRC182_2: RC182.2 RC593.1
NetRC183_1: RC183.1 UC634.6 UC634.7
NetRC185_2: RC185.2 RC195.1
NetRC186_1: RC186.1 UC638.5
NetRC186_2: RC186.2 UC16.3
NetRC187_2: RC187.2 UC638.8 UC638.9
NetRC189_1: RC189.1 UC638.6 UC638.7
NetRC190_1: RC190.1 UC16.13
NetRC190_2: RC190.2 UC638.10
NetRC193_1: RC193.1 UC16.11
NetRC194_1: RC194.1 UC16.4
NetRC533_2: RC533.2 UC50.1 UC50.6
NetRC706_1: RC706.1 UC636.2
NetUC634_8: UC634.8 UC634.9

## Notes on the sheet
- R
- 市电电压检测，过零检测
- 输入电压电流采样
- 输出电流采样/保护 /DCI检测
- 前端采样电阻串阻值：499K*7+5=3498K
- GAIN=10/3498
- PV电压为1000V时 输出2.86V
- GAIN=10/1397
- 前端采样电阻串阻值：348K*4+5=1397K
- Vsamp=389*(10/1397)/2+1.5=2.89V
- 275V *1.414=389V
- Igrid=3.75/3+1.5=2.75V
- T
- UTH=1.5V
- UTL=1.3V
- S
- 输出过流保护
- (near RC73) 布局后看能否用一个2903，085-00091-01
- Bus电压采样 / 过电压保护
- 保护电压：432V  对应Uth=2.48V
- (near RC110) 恢复电压：401V  对应Uth=2.3V
- (near RC511) Vth=3.75*1.2-0.5=4V
- (near RC143) 数值待重新计算
- (near RC104) GAIN=10/1745  半BUS电压为500V时 输出2.87V
- (near RC110) 备注：17K软件报警点为960V
- 前端采样电阻串阻值：348K*5+5=1745K
- GAIN=10/1325
- 逆变电压采样
- 调改运放位号
- (in symbol 050-210000-0 SOT223) ADJ/GND
- (in symbol 74LS00, part A) DM74LS00M
- (in symbol 74LS00, part B) DM74LS00M
- (in symbol 74LS00, part C) DM74LS00M
- (in symbol 74LS00, part D) DM74LS00M
- (in symbol IC 239SM, part A) -; +
- (in symbol IC 239SM, part B) -; +
- (in symbol IC 239SM, part C) -; +
- (in symbol IC 239SM, part D) -; +
- (in symbol IC 2903TSM, part A) -; LM2903; SM; +
- (in symbol IC 2903TSM, part B) +; SM; LM2903; -
- (in symbol IC 14052BSM) Y0; VDD; Y2; X2; Y; X1; Y3; X; Y1; X0; INH; X3; VEE; A; VSS; B
- (in symbol IC TL074SM, part A) +; (SM); TL074; -
- (in symbol IC TL074SM, part B) +; (SM); TL074; -
- (in symbol IC TL074SM, part C) +; (SM); TL074; -
- (in symbol IC TL074SM, part D) -; +

## Library data of the parts
CC1-CC7 CC10 CC14 CC24 CC26 CC27 CC36-CC38 CC41 CC43 CC53 CC56 CC59 CC61 CC69 CC85 CC86 CC91 CC92 CC96 CC97 CC101 CC102 = C0603 SM: 220pF/50V/J/C0G/0603
CC8 CC9 CC15-CC21 CC32-CC35 CC55 CC62 CC63 CC65 CC66 CC68 CC72 CC76-CC80 CC82 CC84 CC87 CC88 CC90 CC95 CC177 CC178 CC216 CC277 CC280 = C0603 SM: 100nF/50V/J/X7R/0603
CC11-CC13 CC23 CC31 CC39 CC40 CC44 CC52 CC54 = C0603 SM: 22pF/50V/J/C0G/0603
CC45 = 023-102220-0 C0603SM: 1nF/50V/J/C0G/0603; Name of Material: 陶瓷电容; Vendor: 三星/YAGEO; Assembly type: 贴片; PN: 023-102220-0
CC46 = CC0603-104SM: 100nF/50V/J/X7R/0603; Part Type: SMD
CC47 CC64 CC71 CC446-CC449 = C0603 SM: 1nF/50V/J/C0G/0603
CC48 = C0603SM-3: 220pF/50V/J/C0G/0603
CC49 CC60 CC67 CC75 = 023-103220-0 C0603SM: 10nF/50V/J/X7R/0603; Name of Material: 陶瓷电容; Vendor: 三星/YAGEO; Assembly type: 贴片; PN: 023-103220-0
CC57 CC73 = C0603 SM: 100pF/50V/J/C0G/0603
CC58 CC70 = C0603 SM: 470pF/50V/J/C0G/0603
CC93 CC94 CC98-CC100 = C0603 SM: Value: NC
DC1 DC2 DC6 = 17K1SS302: 0.1A/80V/SC-70; Type: 贴片
DC9 = D 1N4148W: 0.15A/75V/SOD-123; Type: 贴片
DC10 = D 1N4148W: Value: NC; Type: 插件
RC1 RC20 RC26 RC30 RC31 RC35 RC37 RC44 RC45 RC48 RC54 RC61 RC64 RC71 RC74 RC88 RC101 RC107 RC112 RC114 RC133 RC140 RC143 RC144 RC147 RC157 RC158 RC165 RC178 RC179 RC192 RC198 RC203 = R0603SM: 10Kohm/1/10W/F/0603
RC2 RC6-RC8 RC10 RC12 RC15 RC19 RC25 RC29 RC32 RC46 RC67 RC68 RC70 RC73 RC84 RC100 RC109 RC110 RC116 RC117 RC122 RC124 RC132 RC135 RC145 RC151 RC163 RC167-RC169 RC174 RC177 RC180 RC181 RC184 RC191 RC199-RC202 = R0603SM: 4.99Kohm/1/10W/F/0603
RC3 RC4 RC11 RC14 RC33 RC39 RC60 RC65 RC72 RC79 RC105 RC111 RC128 RC146 RC166 RC171 RC175 RC183 RC187 RC189 = R0603SM: 2.7Kohm/1/10W/F/0603
RC5 RC21 RC66 RC75 RC113 RC136 = 011-273020-0 R0603SM: 27Kohm/1/10W/F/0603; Name of Material: 厚膜电阻; Vendor: RALEC/YAGEO; Factory model: RTT03 27KF TP/RC0603FR-0727KL/0603WAF2702T5E; Assembly type: 贴片; PN: 011-273020-0
RC9 RC13 RC17 RC22 RC83 RC94 = R0603SM: 15Kohm/1/10W/F/0603
RC16 RC18 RC50 RC52 RC55 RC56 RC91 RC119 RC127 RC137 RC149 = R0603SM: 499ohm/1/10W/F/0603
RC23 RC24 RC34 RC42 RC57 RC69 RC76 RC87 RC99 RC106 = R0603SM: 100ohm/1/10W/F/0603
RC38 RC41 RC51 RC53 RC108 RC131 RC164 RC172 RC176 RC186 RC190 RC196 RC197 RC534 = R0603SM: 1Kohm/1/10W/F/0603
RC43 = 011-103020-0 R0603SM: 10Kohm/1/10W/F/0603; Name of Material: 厚膜电阻; Vendor: RALEC/YAGEO; Factory model: RTT03 10KF TP/RC0603FR-0710KL; Assembly type: 贴片; PN: 011-103020-0
RC58 RC59 RC62 RC63 RC138 RC139 = R0603SM: 300Kohm/1/10W/F/0603
RC103 RC126 RC142 RC152 = R0603SM: 40.2Kohm/1/10W/F/0603
RC104 RC118 = 011-492020-0 R0603SM: 4.99Kohm/1/10W/F/0603; Name of Material: 厚膜电阻; Vendor: RALEC/YAGEO; Factory model: RTT03 4K99F TP/RC0603FR-074K99L; Assembly type: 贴片; PN: 011-492020-0
RC115 = R0603SM: 5.1Kohm/1/10W/F/0603
RC125 = R0603SM: 32.4Kohm/1/10W/F/0603
RC129 = R0603SM: 20Kohm/1/10W/F/0603
RC130 = R0603SM: 0ohm/1/10W/F/0603
RC134 = R0603SM: Value: NC
RC150 RC532 RC533 RC535 = R0603SM_7: 4.7Kohm/1/10W/F/0603
RC161 RC170 RC173 RC193 RC194 RC706 = R0603SM: 4.7Kohm/1/10W/F/0603
  RC173: Value: 4.7Kohm/1/10W/F/0603
RC162 = R0603*4SM: 4.7Kohm/J/0603*4
RC182 RC593 = R1206SM-499K: 499Kohm/1/4W/F/1206; Part Type: SMD
RC185 RC195 = R3W-1K: 5Mohm/1W/F; Vendor: 颖发; Part Type: THD
RC188 RC707-RC710 = R0603SM: 33Kohm/1/10W/F/0603
RC506 RC507 = R0603SM: 200Kohm/1/10W/F/0603
RC511 = R0603SM: 130Kohm/1/10W/F/0603
SC6 = SC50_M4-GND: SC50M4; 物料名称: M4螺丝; H: MM; Value: SC40(M4)
TP2-TP5 TP8-TP10 TP12-TP15 TP17-TP20 TP24 = 17K TPD: Type: 插件; Value: NC
UC12 = 050-210000-0 SOT223: Low Dropout Regulator/SOT-223-3; Name of Material: 集成电路; Vendor: SIPEX; Assembly type: 贴片; PN: 050-210000-0; Factory model: SPX1117M3-L-1-5/TR
UC14 UC16 = IC 14052BSM: Analog Multiplexer/Demultiplexer/SOIC-16
UC50 = 74LS00: Quad 2-Input NAND Gate/SO-14; Value: 74HC00D
UC624 UC627 UC629 UC630 UC632-UC635 UC637 UC638 = IC TL074SM: Operational Amplifier/SOIC-14
UC625 = IC TL072SM: Operational Amplifiers/SO-8; Vendor: TI; Part Type: SMD
UC626 = IC 2903TSM: Voltage Dual Comparator/SOIC-8; Type: 贴片
UC636 = IC 239SM: Quad Differential Comparator/SOIC-14